# Altium schematic sheet ArduinoRev2.SchDoc
size A
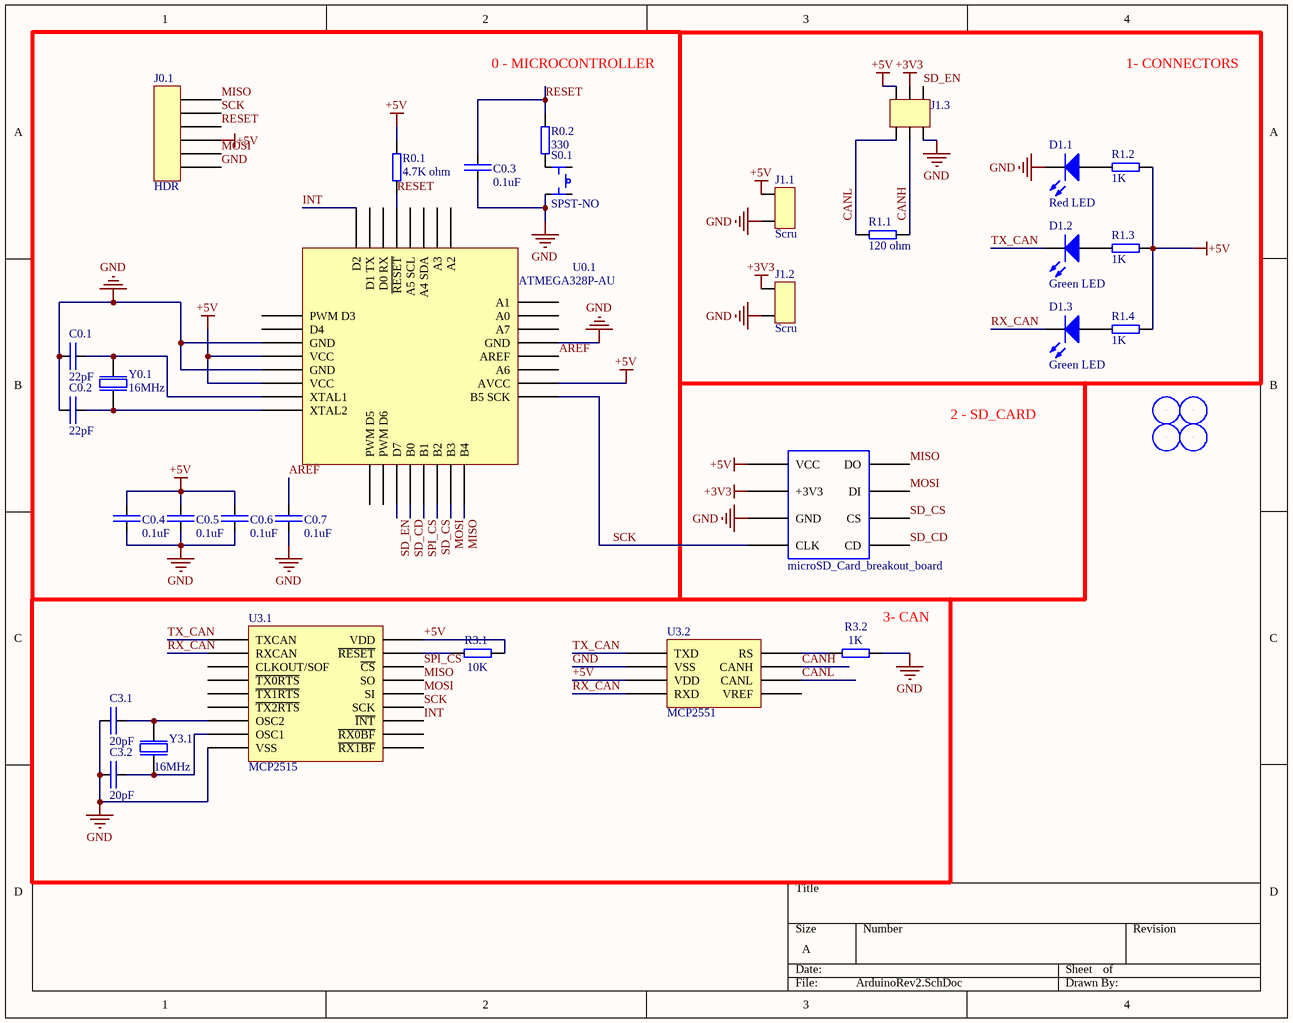
[diagram p0: ArduinoRev2.SchDoc]

## Parts
C0.1  22pF  [C0805]
C0.2  22pF  [C0805]
C0.3  0.1uF  [C0805]
C0.4  0.1uF  [C0805]
C0.5  0.1uF  [C0805]
C0.6  0.1uF  [C0805]
C0.7  0.1uF  [C0805]
C3.1  20pF  [C0805]
C3.2  20pF  [C0805]
D1.1  Red LED  [L0805]
D1.2  Green LED  [L0805]
D1.3  Green LED  [L0805]
J0.1  HDR  [961206-6404-AR]
J1.1  Scru  [5mm 2POS Screw terminal]
J1.2  Scru  [5mm 2POS Screw terminal]
J1.3  43045-0600  [Micro-Fit 3.0 6pos]  (value not drawn)
M1  3mm Mounting Hole  [3mm Mounting Hole]  (value not drawn)
M2  3mm Mounting Hole  [3mm Mounting Hole]  (value not drawn)
M3  3mm Mounting Hole  [3mm Mounting Hole]  (value not drawn)
M4  3mm Mounting Hole  [3mm Mounting Hole]  (value not drawn)
R0.1  4.7K ohm  [R0805]
R0.2  330  [R0805]
R1.1  120 ohm  [R0805]
R1.2  1K  [R0805]
R1.3  1K  [R0805]
R1.4  1K  [R0805]
R3.1  10K  [R0805]
R3.2  1K  [R0805]
S0.1  SPST-NO  [PTS526 SM15 SMTR2 LFS]
U0.1  ATMEGA328P-AU  [TQFP80P900X900X120-32N]
U2.1  microSD_Card_breakout_board  [Adafruit microSD_breakoutboard]
U3.1  MCP2515  [SOP18]
U3.2  MCP2551  [SOP8]
Y0.1  16MHz  [ECS-160-20-3X-TR]
Y3.1  16MHz  [ECS-160-20-3X-TR]

## Blocks framed on the sheet
0 - MICROCONTROLLER: C0.1-C0.7 J0.1 R0.1 R0.2 S0.1 U0.1 Y0.1

## Nets
+3V3: J1.2.1 J1.3.5 U2.1.2(+3V3)
+5V: C0.4.2 C0.5.2 C0.6.2 J0.1.4 J1.1.1 J1.3.6 R0.1.2 R1.2.2 R1.3.2 R1.4.2 R3.1.2 U0.1.4(VCC) U0.1.6(VCC) U0.1.18(AVCC) U2.1.1(VCC) U3.1.18(VDD) U3.2.3(VDD)
GND: C0.1.1 C0.2.1 C0.3.1 C0.4.1 C0.5.1 C0.6.1 C0.7.1 C3.1.1 C3.2.1 D1.1.2(K) J0.1.6 J1.1.2 J1.2.2 J1.3.1 R3.2.2 S0.1.3(NO) U0.1.3(GND) U0.1.5(GND) U0.1.21(GND) U2.1.3(GND) U3.1.9(VSS) U3.2.2(VSS)
AREF: C0.7.2 U0.1.20(AREF)
CANH: J1.3.2 R1.1.2 U3.2.7(CANH)
CANL: J1.3.3 R1.1.1 U3.2.6(CANL)
INT: U0.1.32(D2) U3.1.12(~{INT})
MISO: J0.1.1 U0.1.16(B4) U2.1.5(DO) U3.1.15(SO)
MOSI: J0.1.5 U0.1.15(B3) U2.1.6(DI) U3.1.14(SI)
RESET: C0.3.2 J0.1.3 R0.1.1 R0.2.2 U0.1.29(~{RESET})
RX_CAN: D1.3.2(K) U3.1.2(RXCAN) U3.2.4(RXD)
SCK: J0.1.2 U0.1.17(B5_SCK) U2.1.4(CLK) U3.1.13(SCK)
SD_CD: U0.1.12(B0) U2.1.8(CD)
SD_CS: U0.1.14(B2) U2.1.7(CS)
SD_EN: J1.3.4 U0.1.11(D7)
SPI_CS: U0.1.13(B1) U3.1.16(~{CS})
TX_CAN: D1.2.2(K) U3.1.1(TXCAN) U3.2.1(TXD)
NetC0.1_2: C0.1.2 U0.1.7(XTAL1) Y0.1.2
NetC0.2_2: C0.2.2 U0.1.8(XTAL2) Y0.1.1
NetC3.1_2: C3.1.2 U3.1.7(OSC2) Y3.1.2
NetC3.2_2: C3.2.2 U3.1.8(OSC1) Y3.1.1
NetD1.1_1: D1.1.1(A) R1.2.1
NetD1.2_1: D1.2.1(A) R1.3.1
NetD1.3_1: D1.3.1(A) R1.4.1
NetR0.2_1: R0.2.1 S0.1.1(COM)
NetR3.1_1: R3.1.1 U3.1.17(~{RESET})
NetR3.2_1: R3.2.1 U3.2.8(RS)

Not connected (* = marked no-connect by the designer): M1 1; M2 1; M3 1; M4 1; S0.1 2(COM) 4(NO); U0.1 1(PWM_D3) 2(D4) 9(PWM_D5) 10(PWM_D6) 19(A6) 22(A7) 23(A0) 24(A1) 25(A2) 26(A3) 27(A4_SDA) 28(A5_SCL) 30(D0_RX) 31(D1_TX); U3.1 3(CLKOUT/SOF) 4(~{TX0RTS}) 5(~{TX1RTS}) 6(~{TX2RTS}) 10(~{RX1BF}) 11(~{RX0BF}); U3.2 5(VREF)

## Notes on the sheet
- 1- CONNECTORS
- 2 - SD_CARD
- (near R3.2) 3- CAN

## Library data of the parts
C0.1 C0.2 = CC0805JRNPO9BN220: CAP CER 22PF 50V C0G/NPO 0805
C0.3-C0.7 = CL21B104KBCWPNC: CAP CER 0.1UF 50V X7R 0805; Manufacturer: Samsung; Capacitance: 100nF; Tolerance: 10%; Supplier 1: Digi-Key; Supplier Part Number 1: 1276-6557-1-ND; Manufacturer Part Number: CL21B104KBCWPNC; Stock 1: 6545; Pricing 1: 1 = 0.10000, 10 = 0.06700, 100 = 0.02990, 500 = 0.02138, 1000 = 0.01680 (USD); RoHS: Yes; Mount: Surface Mount; Case/Package: 0805; Case Code (Metric): 2012; Case Code (Imperial): 0805; Min Operating Temperature: -55°C; Max Operating Temperature: 125°C; Packaging: Tape and Reel; Voltage Rating: 50V; Features: Soft Termination; Length: 0.079inch; Width: 0.049inch; Thickness: 0.053inch; Ratings: AEC-Q200; Category: Capacitors
C3.1 C3.2 = C0805C200J5GACTU: CAP CER 20PF 50V C0G/NP0 0805; Manufacturer: Samsung; Manufacturer Part Number: CL21B103KBANNNC; Material: Ceramic; Capacitance: 10nF; Tolerance: 10%; Dielectric: X7R; RoHS: Yes; Mount: Surface Mount; Case/Package: 0805; Case Code (Metric): 2012; Case Code (Imperial): 0805; Contact Plating: Tin; Min Operating Temperature: -55°C; Max Operating Temperature: 125°C; Packaging: Tape and Reel; Voltage Rating: 50V; Voltage: 50V; Voltage Rating (DC): 50V; Length: 2mm; Height: 0.65mm; Width: 0.049inch; Thickness: 0.03inch; Depth: 1.25mm; Radiation Hardening: No; Lead Free: Lead Free; Category: Capacitors; ComponentLink1Description: https://www.digikey.com/product-detail/en/kemet/C0805C200J5GACTU/399-8033-1-ND/3471756; ComponentLink1URL: https://www.digikey.com/product-detail/en/kemet/C0805C200J5GACTU/399-8033-1-ND/3471756; Supplier 1: Digi-Key; Supplier Part Number 1: 399-8033-1-ND
D1.1 = SML-LXT0805SRW-TR: LED RED DIFFUSED 0805 SMD; Manufacturer: Lumex; Lens Color: White; Forward Current: 20mA; Forward Voltage: 1.8V; Power Rating: 80mW; Luminous Intensity: 21mcd; Viewing Angle: 140°; Wavelength: 660nm; Number of LEDs: 1; Supplier 1: Digi-Key; Supplier Part Number 1: 67-1555-1-ND; Manufacturer Part Number: SML-LXT0805SRW-TR; Stock 1: 60948; Pricing 1: 1 = 0.51000, 10 = 0.36600, 25 = 0.28080, 100 = 0.18320, 250 = 0.13432, 500 = 0.11396, 1000 = 0.09361 (USD); RoHS: Yes; Mount: Surface Mount; Case/Package: 0805; Number of Pins: 2; Color: Red; Case Code (Metric): 2012; Case Code (Imperial): 0805; Min Operating Temperature: -25°C; Max Operating Temperature: 80°C; Illumination Color: Red; Packaging: Tape and Reel; Lens Style: Diffused; Package Quantity: 1; Test Current: 20mA; Lens Transparency: Diffused; Length: 2mm; Height: 0.8mm; Width: 1.25mm; REACH SVHC: No SVHC; Lead Free: Lead Free; ComponentLink1URL: https://datasheet.ciiva.com/15967/smllxt0805srwtr-15967412.pdf?src-supplier=Onlinecomponents.com; ComponentLink1Description: https://datasheet.ciiva.com/15967/smllxt0805srwtr-15967412.pdf?src-supplier=Onlinecomponents.com; ComponentLink2URL: https://datasheet.ciiva.com/4688/sml-lxt0805srw-tr-114457-4688733.pdf?src-supplier=Mouser; ComponentLink2Description: https://datasheet.ciiva.com/4688/sml-lxt0805srw-tr-114457-4688733.pdf?src-supplier=Mouser; ComponentLink3URL: https://datasheet.ciiva.com/2110/sml-lxt0805srw-tr-2110039.pdf?src-supplier=Digi-Key; ComponentLink3Description: https://datasheet.ciiva.com/2110/sml-lxt0805srw-tr-2110039.pdf?src-supplier=Digi-Key; ComponentLink4URL: https://datasheet.ciiva.com/2110/sml-lxt0805srw-tr-2110040.pdf?src-supplier=Digi-Key; ComponentLink4Description: https://datasheet.ciiva.com/2110/sml-lxt0805srw-tr-2110040.pdf?src-supplier=Digi-Key; ComponentLink5URL: https://datasheet.ciiva.com/2110/sml-lxt0805srw-tr-2110041.pdf?src-supplier=Digi-Key; ComponentLink5Description: https://datasheet.ciiva.com/2110/sml-lxt0805srw-tr-2110041.pdf?src-supplier=Digi-Key; ComponentLink6URL: https://datasheet.ciiva.com/16376/sml-lxt0805srw-tr-16376845.pdf?src-supplier=Future+Electronics; ComponentLink6Description: https://datasheet.ciiva.com/16376/sml-lxt0805srw-tr-16376845.pdf?src-supplier=Future+Electronics; Category: Optoelectronics
D1.2 D1.3 = SML-LXT0805GW-TR: LED GREEN DIFFUSED SMD; Manufacturer: Lumex; Lens Color: White; Viewing Angle: 140°; Lens Style: Rectangular; Luminous Intensity: 11mcd; Forward Voltage: 2V; Wavelength: 565nm; Forward Current: 20mA; Power Rating: 50mW; Dominant Wavelength: 568nm; Number of LEDs: 1; Approvals: UL; Supplier 1: Digi-Key; Supplier Part Number 1: 67-1553-1-ND; Manufacturer Part Number: SML-LXT0805GW-TR; Stock 1: 417501; Pricing 1: 1 = 0.41000, 10 = 0.29000, 25 = 0.25160, 100 = 0.19360, 250 = 0.15732, 500 = 0.11616, 1000 = 0.09680 (USD); RoHS: Yes; Mount: Surface Mount; Case/Package: 0805; Number of Pins: 2; Color: Green; Case Code (Metric): 2012; Case Code (Imperial): 0805; Min Operating Temperature: -25°C; Max Operating Temperature: 85°C; Package Quantity: 1; Packaging: Tape and Reel; Illumination Color: Green; Test Current: 20mA; Lens Transparency: Diffused; Length: 2mm; Height: 0.8mm; Width: 1.25mm; REACH SVHC: No SVHC; Lead Free: Lead Free; ComponentLink1URL: https://datasheet.ciiva.com/2110/sml-lxt0805gw-tr-2110192.pdf?src-supplier=Digi-Key; ComponentLink1Description: https://datasheet.ciiva.com/2110/sml-lxt0805gw-tr-2110192.pdf?src-supplier=Digi-Key; ComponentLink2URL: https://datasheet.ciiva.com/4689/sml-lxt0805gw-tr-82662-4689266.pdf?src-supplier=Mouser; ComponentLink2Description: https://datasheet.ciiva.com/4689/sml-lxt0805gw-tr-82662-4689266.pdf?src-supplier=Mouser; ComponentLink3URL: https://datasheet.ciiva.com/30063/sml-lxt0805gw-tr-30063898.pdf?src-supplier=Onlinecomponents.com; ComponentLink3Description: https://datasheet.ciiva.com/30063/sml-lxt0805gw-tr-30063898.pdf?src-supplier=Onlinecomponents.com; ComponentLink4URL: https://datasheet.ciiva.com/2110/sml-lxt0805gw-tr-2110193.pdf?src-supplier=Digi-Key; ComponentLink4Description: https://datasheet.ciiva.com/2110/sml-lxt0805gw-tr-2110193.pdf?src-supplier=Digi-Key; ComponentLink5URL: https://datasheet.ciiva.com/2110/sml-lxt0805gw-tr-2110194.pdf?src-supplier=Digi-Key; ComponentLink5Description: https://datasheet.ciiva.com/2110/sml-lxt0805gw-tr-2110194.pdf?src-supplier=Digi-Key; ComponentLink6URL: https://datasheet.ciiva.com/16383/sml-lxt0805gw-tr-16383723.pdf?src-supplier=Future+Electronics; ComponentLink6Description: https://datasheet.ciiva.com/16383/sml-lxt0805gw-tr-16383723.pdf?src-supplier=Future+Electronics; Category: Optoelectronics
J0.1 = 961206-6404-AR: CONN HEADER VERT 6POS 2.54MM; ComponentLink1Description: datasheet; ComponentLink1URL: https://media.digikey.com/pdf/Data%20Sheets/3M%20PDFs/961_2.54mm_StraightSolderTail_DS.pdf; ComponentLink2Description: digikey; ComponentLink2URL: https://www.digikey.com/product-detail/en/3m/961206-6404-AR/3M9466-06-ND/7105229
J1.1 J1.2 = 5mm 2POS Screw terminal
J1.3 = 43045-0600: Micro-fit 3.0 6pos right-angle; Manufacturer: Molex; Manufacturer Part Number: 43045-0612; Number of Positions: 6; Number of Ports: 1; Gender: Male; Current Rating: 5A; Voltage Rating: 250V; Contact Resistance: 10mR; Max Voltage Rating (DC): 250.25kV; Pitch: 3mm; Glow Wire Compliant: Compliant; Approvals: UL,CSA,TUV; RoHS: Yes; Category: Headers and Wire Housings; Stock 1: 8230; Mount: Through Hole; Case/Package: 0612; Housing Material: Polymer; Housing Color: Black; Contact Material: Brass,Tin; Contact Plating: Tin; Color: Black; Number of Terminals: 6; Material: Thermoplastic; Min Operating Temperature: -40°C; Max Operating Temperature: 105°C; Termination: Solder; Number of Contacts: 6; Orientation: Vertical; Number of Rows: 2; Packaging: Tray; Number of Circuits: 6; Package Quantity: 1728; Max Current Rating: 5A; Diameter: 3mm; Length: 13.15mm; Height: 9.91mm; Row Spacing: 3mm; Depth: 8.77mm; Radiation Hardening: No; Flammability Rating: UL94 V-0; Halogen Free: Low Halogen; Lead Free: Lead Free; REACH SVHC: Unknown; ComponentLink1URL: https://datasheet.ciiva.com/30194/128550430450612-pcb-headers-30194512.pdf?src-supplier=Onlinecomponents.com; ComponentLink1Description: https://datasheet.ciiva.com/30194/128550430450612-pcb-headers-30194512.pdf?src-supplier=Onlinecomponents.com; ComponentLink2URL: https://datasheet.ciiva.com/5159/0430450612-pcb-headers-142990-5159553.pdf?src-supplier=Mouser; ComponentLink2Description: https://datasheet.ciiva.com/5159/0430450612-pcb-headers-142990-5159553.pdf?src-supplier=Mouser; ComponentLink3URL: https://datasheet.ciiva.com/11748/0900766b800bd7d2-11748707.pdf?src-supplier=RSComponents; ComponentLink3Description: https://datasheet.ciiva.com/11748/0900766b800bd7d2-11748707.pdf?src-supplier=RSComponents; ComponentLink4URL: https://datasheet.ciiva.com/19462/883464-19462371.pdf?src-supplier=Jameco; ComponentLink4Description: https://datasheet.ciiva.com/19462/883464-19462371.pdf?src-supplier=Jameco; ComponentLink5URL: https://datasheet.ciiva.com/16658/0430450612-pcb-headers-16658411.pdf?src-supplier=Avnet+Europe; ComponentLink5Description: https://datasheet.ciiva.com/16658/0430450612-pcb-headers-16658411.pdf?src-supplier=Avnet+Europe; ComponentLink6URL: https://datasheet.ciiva.com/20209/22-3730e-20209515.pdf?src-supplier=Rapid+Electronics; ComponentLink6Description: https://datasheet.ciiva.com/20209/22-3730e-20209515.pdf?src-supplier=Rapid+Electronics; ComponentLink7URL: https://datasheet.ciiva.com/9468/0430450612-pcb-headers-9468492.pdf?src-supplier=Avnet; ComponentLink7Description: https://datasheet.ciiva.com/9468/0430450612-pcb-headers-9468492.pdf?src-supplier=Avnet; Supplier 1: Digi-Key; Supplier Part Number 1: WM1815-ND
R0.1 = RC0805JR-074K7L: RES SMD 4.7K OHM 5% 1/8W 0805; ComponentLink1Description: digikey; ComponentLink1URL: https://www.digikey.ca/en/products/detail/yageo/RC0805JR-074K7L/728327
R0.2 = RC0805JR-074K7L_1: RES SMD 330 OHM 5% 1/8W 0805; ComponentLink1Description: digikey; ComponentLink1URL: https://www.digikey.ca/en/products/detail/yageo/RC0805JR-07330RL/731258
R1.1 = ERJ6ENV1200V: RES SMD 120 OHM 1% 1/8W 0805; ComponentLink1Description: https://datasheet.ciiva.com/11821/0900766b80f80784-11821533.pdf?src-supplier=RSComponents; ComponentLink1URL: https://datasheet.ciiva.com/11821/0900766b80f80784-11821533.pdf?src-supplier=RSComponents; Supplier 1: Digi-Key; Supplier Part Number 1: P120CCT-ND
R1.2-R1.4 R3.2 = ERJ6ENF1001V: RES SMD 1K OHM 1% 1/8W 0805; Manufacturer: Panasonic; Resistance: 1kR; Power Rating: 125mW; Temperature Coefficient: 100ppm/°C; Voltage Rating (DC): 150V; Supplier 1: Digi-Key; Supplier Part Number 1: P1.00KCCT-ND; Manufacturer Part Number: ERJ6ENF1001V; Stock 1: 946321; Pricing 1: 1 = 0.100000, 10 = 0.081000, 100 = 0.031100, 1000 = 0.013670, 2500 = 0.011810 (USD); RoHS: Yes; Mount: Surface Mount; Case/Package: 0805; Number of Pins: 2; Case Code (Metric): 2012; Case Code (Imperial): 0805; Contact Plating: Tin; Min Operating Temperature: -55°C; Max Operating Temperature: 155°C; Tolerance: 1%; Packaging: Tape and Reel; Number of Terminations: 2; Package Quantity: 1; Voltage Rating: 150V; Composition: Thick Film; Termination: SMD/SMT; Military Standard: Not; Max Power Dissipation: 125mW; Features: Automotive AEC-Q200; Length: 2mm; Height: 0.6mm; Width: 0.049inch; Depth: 1.25mm; Radiation Hardening: No; REACH SVHC: No SVHC; Lead Free: Lead Free; ComponentLink1URL: https://datasheet.ciiva.com/34303/1988962-34303619.pdf?src-supplier=Jameco; ComponentLink1Description: https://datasheet.ciiva.com/34303/1988962-34303619.pdf?src-supplier=Jameco; ComponentLink2URL: https://datasheet.ciiva.com/11808/0900766b80f80784-11808500.pdf?src-supplier=RSComponents; ComponentLink2Description: https://datasheet.ciiva.com/11808/0900766b80f80784-11808500.pdf?src-supplier=RSComponents; ComponentLink3URL: https://datasheet.ciiva.com/28532/426256-28532134.pdf?src-supplier=Element14; ComponentLink3Description: https://datasheet.ciiva.com/28532/426256-28532134.pdf?src-supplier=Element14; ComponentLink4URL: https://datasheet.ciiva.com/30051/aoa0000ce2-30051974.pdf?src-supplier=Onlinecomponents.com; ComponentLink4Description: https://datasheet.ciiva.com/30051/aoa0000ce2-30051974.pdf?src-supplier=Onlinecomponents.com; ComponentLink5URL: https://datasheet.ciiva.com/16774/70260748-16774249.pdf?src-supplier=Allied+Electronics; ComponentLink5Description: https://datasheet.ciiva.com/16774/70260748-16774249.pdf?src-supplier=Allied+Electronics; ComponentLink6URL: https://datasheet.ciiva.com/46373/1678782-46373337.pdf?src-supplier=Element14; ComponentLink6Description: https://datasheet.ciiva.com/46373/1678782-46373337.pdf?src-supplier=Element14; ComponentLink7URL: https://datasheet.ciiva.com/46373/1678782-46373338.pdf?src-supplier=Element14; ComponentLink7Description: https://datasheet.ciiva.com/46373/1678782-46373338.pdf?src-supplier=Element14; ComponentLink8URL: https://datasheet.ciiva.com/48532/aoa0000ce2-48532156.pdf?src-supplier=Avnet; ComponentLink8Description: https://datasheet.ciiva.com/48532/aoa0000ce2-48532156.pdf?src-supplier=Avnet; ComponentLink9URL: https://datasheet.ciiva.com/7942/426256-7942429.pdf?src-supplier=Element14; ComponentLink9Description: https://datasheet.ciiva.com/7942/426256-7942429.pdf?src-supplier=Element14; ComponentLink10URL: https://datasheet.ciiva.com/16199/aoa0000ce2-16199262.pdf?src-supplier=Future+Electronics; ComponentLink10Description: https://datasheet.ciiva.com/16199/aoa0000ce2-16199262.pdf?src-supplier=Future+Electronics; ComponentLink11URL: https://datasheet.ciiva.com/9117/aoa0000ce2-9117391.pdf?src-supplier=Avnet; ComponentLink11Description: https://datasheet.ciiva.com/9117/aoa0000ce2-9117391.pdf?src-supplier=Avnet; ComponentLink12URL: https://datasheet.ciiva.com/16523/aoa0000ce2-16523855.pdf?src-supplier=Avnet+Asia; ComponentLink12Description: https://datasheet.ciiva.com/16523/aoa0000ce2-16523855.pdf?src-supplier=Avnet+Asia; Category: Resistors
R3.1 = ERJ6ENF1002V: RES SMD 10K OHM 1% 1/8W 0805; Manufacturer: Yageo; Manufacturer Part Number: ERJ-6ENF1002V; Temperature Coefficient: 100ppm/°C; Voltage Rating (DC): 150V; Power Rating: 125mW; Resistance: 10000R; Supplier 1: Digi-Key; Supplier Part Number 1: P10.0KCCT-ND; Stock 1: 3342401; Pricing 1: 1 = 0.100000, 10 = 0.081000, 100 = 0.031100, 1000 = 0.013670, 2500 = 0.011810 (USD); RoHS: No; Mount: Surface Mount; Case/Package: 0805; Number of Pins: 2; Min Operating Temperature: -55°C; Max Operating Temperature: 155°C; Packaging: Tape and Reel; Tolerance: 1%; Length: 2mm; Height: 0.5mm; Depth: 1.25mm; Width: 1.25mm; REACH SVHC: No SVHC; Lead Free: Lead Free; ComponentLink1URL: https://datasheet.ciiva.com/27056/2078477-27056611.pdf?src-supplier=Jameco; ComponentLink1Description: https://datasheet.ciiva.com/27056/2078477-27056611.pdf?src-supplier=Jameco; Category: Resistors
S0.1 = PTS526SM15SMTR2LFS: TACT 5.2 X 5.2, 1.5 MM H, 160GF, Tactile Switch SPST-NO Top Actuated Surface Mount; Manufacturer: ITT C&K; Supplier 1: Digi-Key; Supplier Part Number 1: CKN12220-1-ND; Manufacturer Part Number: PTS526SM15SMTR2LFS; RoHS: No; Stock 1: 5534
U3.1 = MCP2515: Stand-Alone CAN Controller with SPI Interface; ComponentLink1Description: datasheet; ComponentLink1URL: http://ww1.microchip.com/downloads/en/DeviceDoc/MCP2515-Stand-Alone-CAN-Controller-with-SPI-20001801J.pdf
U3.2 = MCP2551: High Speed Can Transceiver; ComponentLink1Description: daatasheet; ComponentLink1URL: http://ww1.microchip.com/downloads/en/DeviceDoc/20001667G.pdf
Y0.1 Y3.1 = ECS-160-20-3X-TR: CRYSTAL 16.0000MHZ 20PF SMD; ComponentLink1Description: https://www.digikey.ca/en/products/detail/ecs-inc/ECS-160-20-3X-TR/2676606; ComponentLink1URL: https://www.digikey.ca/en/products/detail/ecs-inc/ECS-160-20-3X-TR/2676606
U0.1 = ATMEGA328P-AU: Date Created: 2/1/2020; Created by: Joseph Park; ComponentLink1Description: digikey; ComponentLink1URL: https://www.mouser.ca/ProductDetail/Microchip-Technology-Atmel/ATMEGA328P-AU?qs=K8BHR703ZXiCmmgp6%2FGNmQ%3D%3D